# EAGLE design Status Board (EAGLE 9.2.2)
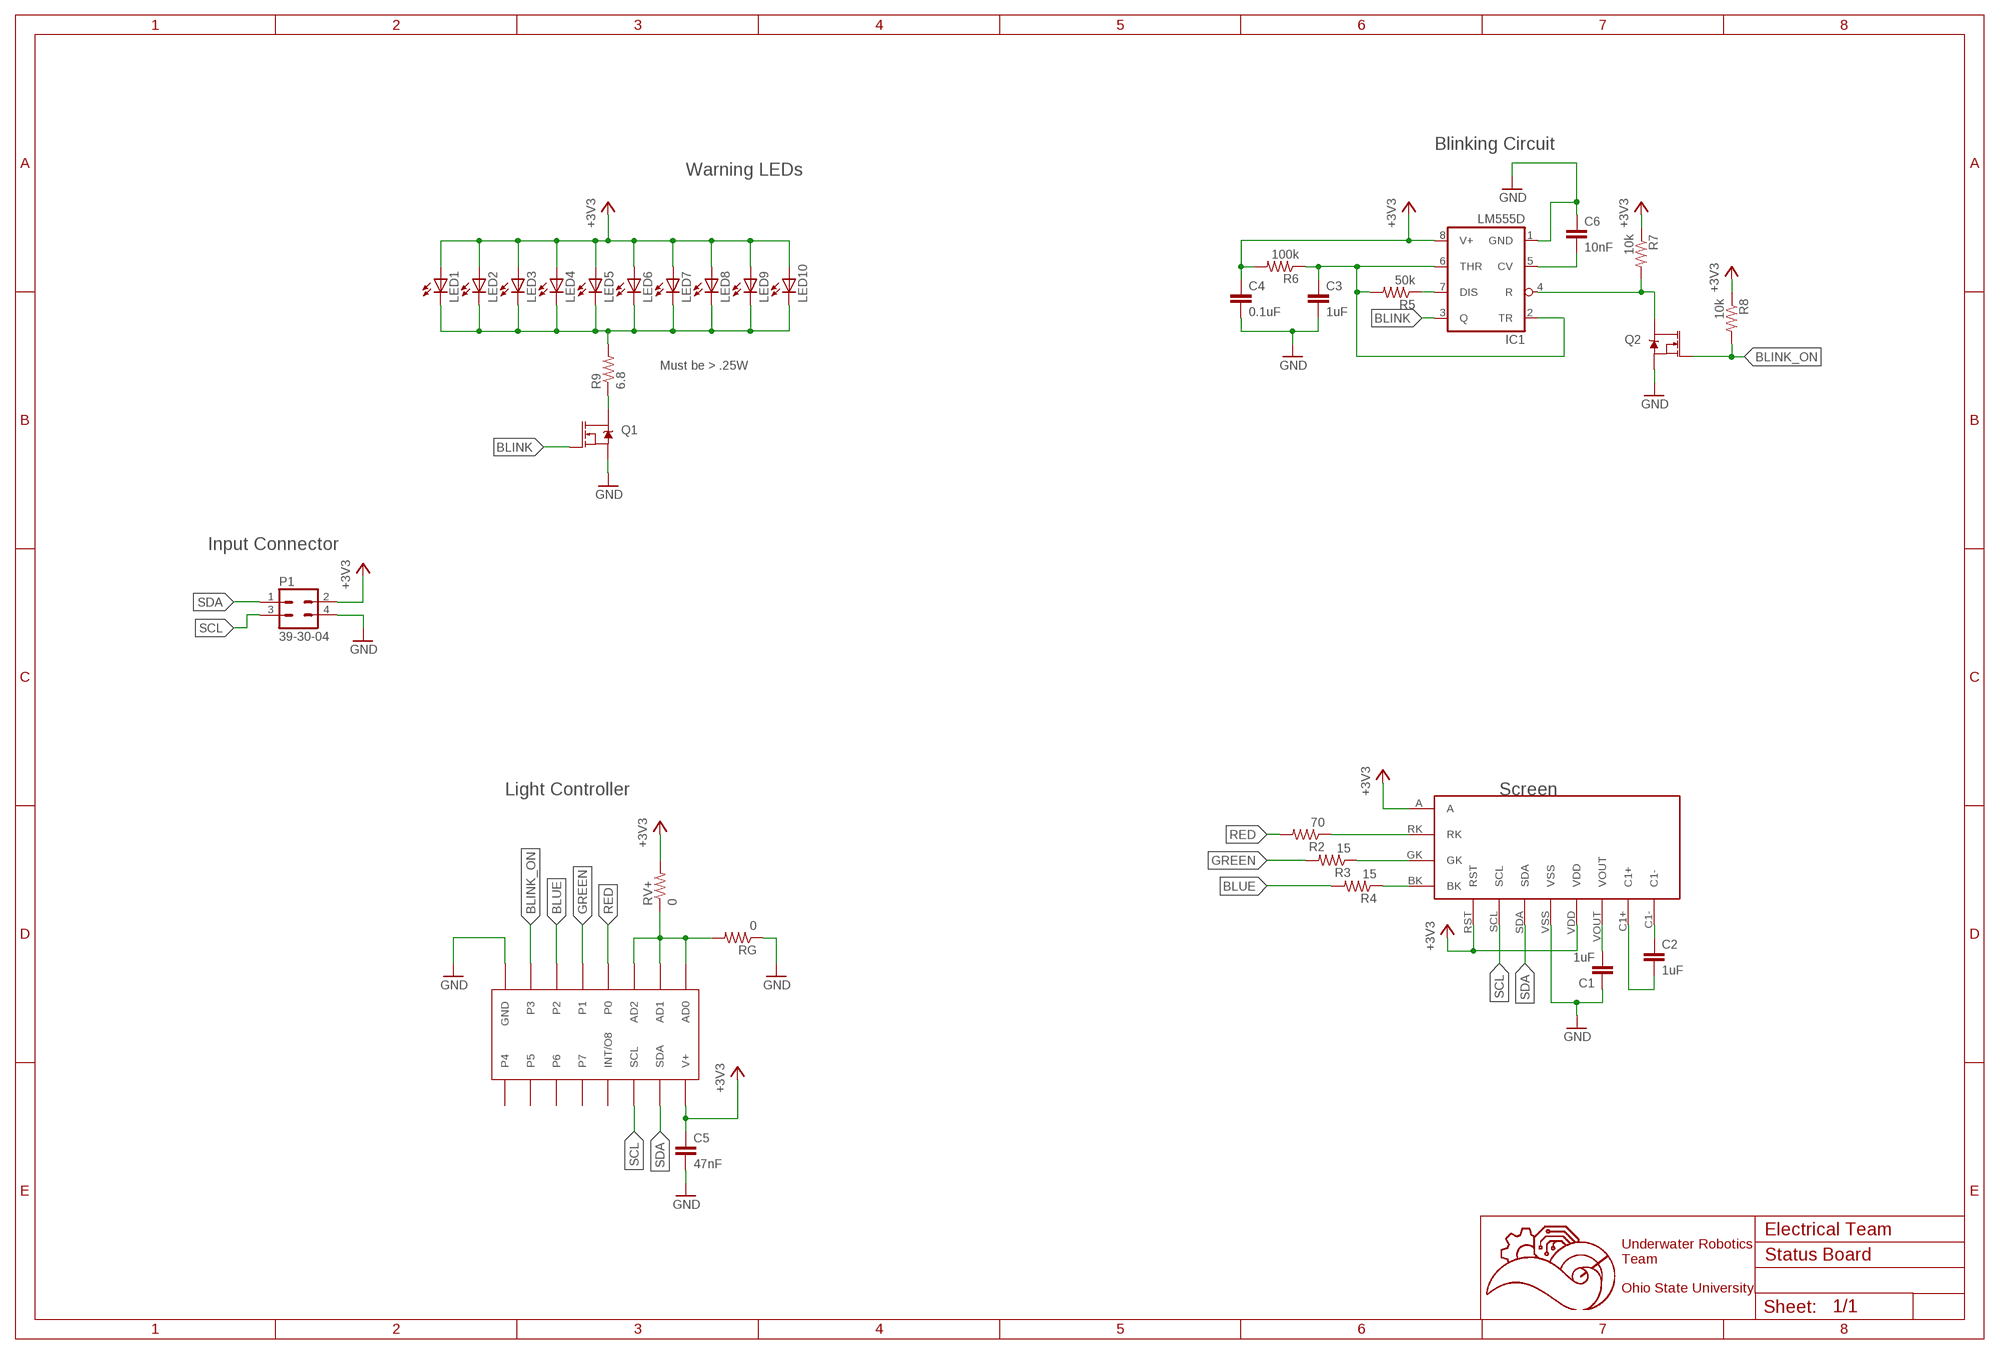
[diagram p0: schematic, sheet 1]

## Parts
C1  1uF  C-EUC0603  [C0603]
C2  1uF  C-EUC0603  [C0603]
C3  1uF  C-EUC0603  [C0603]
C4  0.1uF  C-EUC0603  [C0603]
C5  47nF  C-EUC0603  [C0603]
C6  10nF  C-EUC0603  [C0603]
IC1  LM555D  [SO08]
LED1  LEDCHIPLED_0603  [CHIPLED_0603]
LED2  LEDCHIPLED_0603  [CHIPLED_0603]
LED3  LEDCHIPLED_0603  [CHIPLED_0603]
LED4  LEDCHIPLED_0603  [CHIPLED_0603]
LED5  LEDCHIPLED_0603  [CHIPLED_0603]
LED6  LEDCHIPLED_0603  [CHIPLED_0603]
LED7  LEDCHIPLED_0603  [CHIPLED_0603]
LED8  LEDCHIPLED_0603  [CHIPLED_0603]
LED9  LEDCHIPLED_0603  [CHIPLED_0603]
LED10  LEDCHIPLED_0603  [CHIPLED_0603]
P1  39-30-04  [39-30-?04?]
Q1  310mA/60V/1.6Ω  MOSFET-NCH-2N7002PW  [SOT323]
Q2  310mA/60V/1.6Ω  MOSFET-NCH-2N7002PW  [SOT323]
R2  70  R-US_R0603  [R0603]
R3  15  R-US_R0603  [R0603]
R4  15  R-US_R0603  [R0603]
R5  50k  R-US_R0603  [R0603]
R6  100k  R-US_R0603  [R0603]
R7  10k  R-US_R0603  [R0603]
R8  10k  R-US_R0603  [R0603]
R9  6.8  R-US_R0603  [R0603]
RG  0  R-US_R0603  [R0603]
RV+  0  R-US_R0603  [R0603]
U$1  NHD-C0220BIZ  [NHD-C0220BIZ]
U$2  MAX7315  [TSSOP-16]

## Nets
+3V3: C4.1 C5.1 IC1.8(V+) LED1.A LED2.A LED3.A LED4.A LED5.A LED6.A LED7.A LED8.A LED9.A LED10.A P1.2 R6.2 R7.1 R8.1 RV+.2 U$1.A U$1.RST U$1.VDD U$2.16(V+)
BLINK: IC1.3(Q) Q1.1(G)
BLINK_OFF: IC1.4(R) Q2.3(D) R7.2
BLINK_ON: Q2.1(G) R8.2 U$2.7(P3)
BLUE: R4.2 U$2.6(P2)
GND: C1.1 C3.2 C4.2 C5.2 C6.1 IC1.1(GND) P1.4 Q1.2(S) Q2.2(S) RG.1 U$1.VSS U$2.8(GND)
GREEN: R3.2 U$2.5(P1)
N$1: R3.1 U$1.GK
N$2: C2.1 U$1.C1-
N$3: C1.2 U$1.VOUT
N$4: C2.2 U$1.C1+
N$5: R4.1 U$1.BK
N$6: RG.2 RV+.1 U$2.1(AD0) U$2.2(AD1) U$2.3(AD2)
N$7: R2.1 U$1.RK
N$8: C6.2 IC1.5(CV)
N$9: IC1.7(DIS) R5.1
N$10: C3.1 IC1.2(TR) IC1.6(THR) R5.2 R6.1
N$12: Q1.3(D) R9.1
N$20: LED1.C LED2.C LED3.C LED4.C LED5.C LED6.C LED7.C LED8.C LED9.C LED10.C R9.2
RED: R2.2 U$2.4(P0)
SCL: P1.3 U$1.SCL U$2.14(SCL)
SDA: P1.1 U$1.SDA U$2.15(SDA)
Unconnected: U$2.9(P4) U$2.10(P5) U$2.11(P6) U$2.12(P7) U$2.13(INT/O8)

## Notes on the sheet
- Blinking Circuit
- Warning LEDs
- Must be > .25W
- Input Connector
- Light Controller | Screen
- Electrical Team
- Underwater Robotics
  Team
  
  Ohio State University

## Library data of the parts
C1-C6 = rcl:C-EU: CAPACITOR, European symbol; SPICEPREFIX: C
IC1 = linear:*555: TIMER
LED1-LED10 = led:LED: LED OSRAM: - CHIPLED LG R971, LG N971, LY N971, LG Q971, LY Q971, LO R971, LY R971 LH N974, LH R974 LS Q976, LO Q976, LY Q976 LO Q996 - Hyper CHIPLED LW Q18S LB Q993, LB Q99A, LB R99A - SideLED LS A670, LO A670, LY A670, LG A670, LP A670 LB A673, LV A673, LT A673, LW A673 LH A674 LY A675 LS A676, LA A676, LO A676, LY A676, LW A676 LS A679, LY A679, LG A679 - Hyper Micro SIDELED® LS Y876, LA Y876, LO Y876, LY Y876 LT Y87S - SmartLED LW L88C, LW L88S LB L89C, LB L89S, LG L890 LS L89K, LO L89K, LY L89K LS L896, LA L896, LO L896, LY L896 - TOPLED LS T670, LO T670, LY T670, LG T670, LP T670 LSG T670, LSP T670, LSY T670, LOP T670, LYG T670 LG T671, LOG T671, LSG T671 LB T673, LV T673, LT T673, LW T673 LH T674 LS T676, LA T676, LO T676, LY T676, LB T676, LH T676, LSB T676, LW T676 LB T67C, LV T67C, LT T67C, LS T67K, LO T67K, LY T67K, LW E67C LS E67B, LA E67B, LO E67B, LY E67B, LB E67C, LV E67C, LT E67C LW T67C LS T679, LY T679, LG T679 LS T770, LO T770, LY T770, LG T770, LP T770 LB T773, LV T773, LT T773, LW T773 LH T774 LS E675, LA E675, LY E675, LS T675 LS T776, LA T776, LO T776, LY T776, LB T776 LHGB T686 LT T68C, LB T68C - Hyper Mini TOPLED® LB M676 - Mini TOPLED Santana® LG M470 LS M47K, LO M47K, LY M47K Source: http://www.osram.convergy.de LUXEON: - LUMILED® LXK2-PW12-R00, LXK2-PW12-S00, LXK2-PW14-U00, LXK2-PW14-V00 LXK2-PM12-R00, LXK2-PM12-S00, LXK2-PM14-U00 LXK2-PE12-Q00, LXK2-PE12-R00, LXK2-PE12-S00, LXK2-PE14-T00, LXK2-PE14-U00 LXK2-PB12-K00, LXK2-PB12-L00, LXK2-PB12-M00, LXK2-PB14-N00, LXK2-PB14-P00, LXK2-PB14-Q00 LXK2-PR12-L00, LXK2-PR12-M00, LXK2-PR14-Q00, LXK2-PR14-R00 LXK2-PD12-Q00, LXK2-PD12-R00, LXK2-PD12-S00 LXK2-PH12-R00, LXK2-PH12-S00 LXK2-PL12-P00, LXK2-PL12-Q00, LXK2-PL12-R00 Source: www.luxeon.com KINGBRIGHT: KA-3528ASYC Source: www.kingbright.com
P1 = con-molex-mini-fit:39-30-?04?: HEADER
Q1 Q2 = SparkFun-DiscreteSemi:MOSFET-NCH: N-channel MOSFETs Voltage controlled devices that allow control of high current outputs. SparkFun Products: SparkFun OpenScale <https://www.sparkfun.com/products/13261> SparkFun Digital Sandbox <https://www.sparkfun.com/products/12651> SparkFun Monster Moto Shield <https://www.sparkfun.com/products/10182> SparkFun MOSFET Power Controller <https://www.sparkfun.com/products/11214>; PROD_ID: TRANS-11151
R2-R9 RG RV+ = rcl:R-US_: RESISTOR, American symbol; SPICEPREFIX: R
U$1 = NHD-C0220BiZ:NHD-C0220BIZ
U$2 = MAX7315:MAX7315

## Board
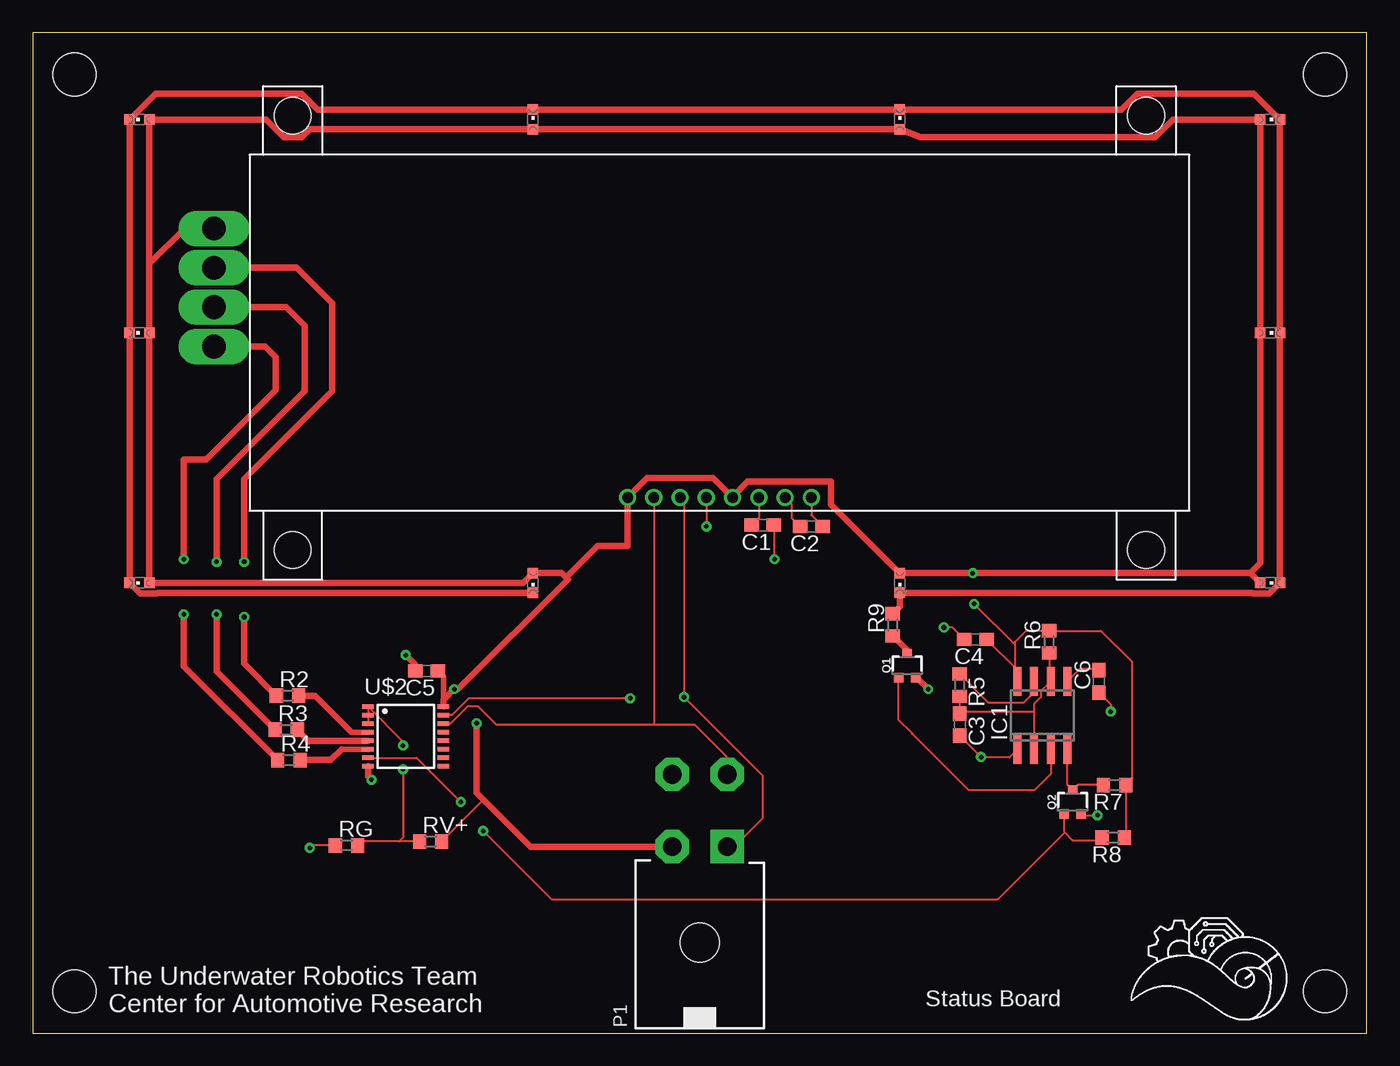
[diagram p1: board, top side]
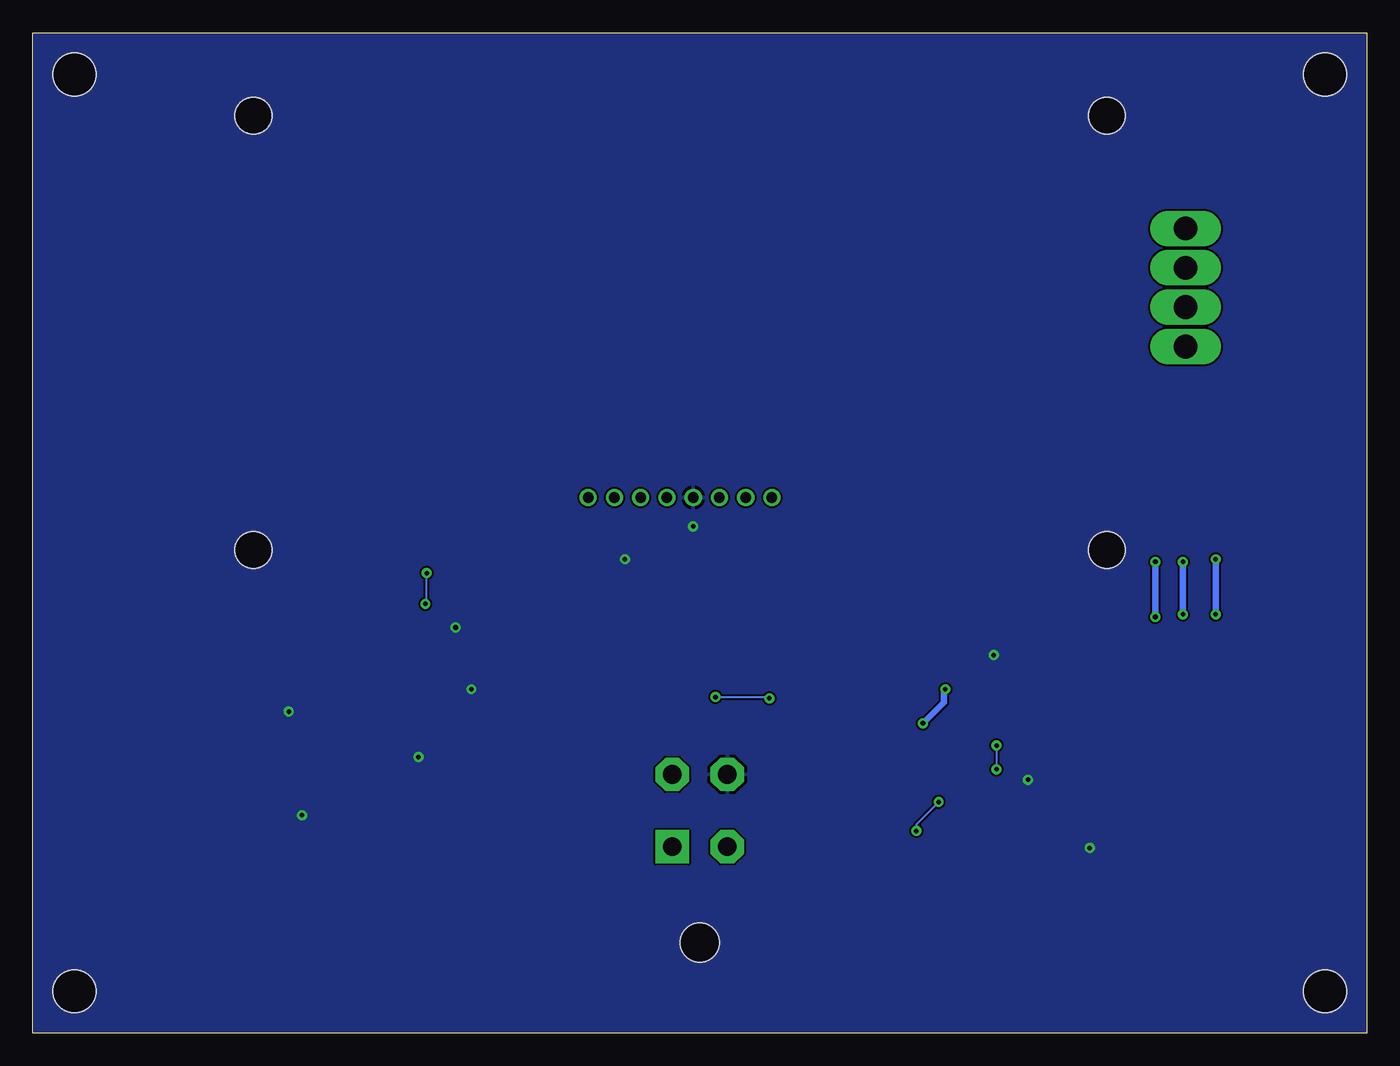
[diagram p2: board, bottom side, seen from below]

Size 101.6 x 76.2 mm. Coordinates in mm from the lower left corner, seen from the top.
Outline: 0,0 101.6,0 101.6,76.2 0,76.2 0,0
Copper layers (1*16): Top 0.035mm / dielectric 1.5mm / Bottom 0.035mm
Design rules "default *": minimum track width 6mil, minimum drill 0.35mm, track to track 6mil, track to pad 6mil, pad to pad 6mil, via to via 6mil, smd to smd 6mil, copper to edge 0.00508125mm, drill to drill 6mil, minimum pad ring 10mil, minimum via ring 8mil, stop-mask expansion 4mil, vias tented up to drill 0mil, thermal gap 10mil
Holes 3.26 mm at 3.17,73.03 98.42,73.03 3.17,3.17 98.42,3.17

### Footprints (pad centres in the part's own frame; a part is rotated, then mirrored left to right if it is on the bottom)
C0603 = smd 1.1 x 1: 1 -0.85,0; 2 0.85,0
SO08 = smd 0.6 x 2.2: 1 -1.905,-2.6; 2 -0.635,-2.6; 3 0.635,-2.6; 4 1.905,-2.6; 5 1.905,2.6; 6 0.635,2.6; 7 -0.635,2.6; 8 -1.905,2.6
CHIPLED_0603 = smd 0.8 x 0.8: A 0,-0.75; C 0,0.75
39-30-?04? = drill 1.422 pad 2.54 square: 1 2.095,0 | drill 1.422 pad 2.54 octagon: 2 -2.095,0; 3 2.095,5.512; 4 -2.095,5.512 | hole 3: 0,-7.3
SOT323 = smd 0.7 x 0.7: 1 -0.65,-0.925; 2 0.65,-0.925; 3 0,0.925
R0603 = smd 1 x 1.1: 1 -0.85,0; 2 0.85,0
NHD-C0220BIZ = drill 1.8 long: A -6,24.5; BK -6,15.5; GK -6,18.5; RK -6,21.5 | drill 0.8: C1+ 37.5,4; C1- 39.5,4; RST 25.5,4; SCL 27.5,4; SDA 29.5,4; VDD 33.5,4; VOUT 35.5,4; VSS 31.5,4 | hole 2.8: 0,0; 65,0; 65,33.1; 0,33.1
TSSOP-16 = smd 0.9 x 0.35: 1 -2.875,2.275; 2 -2.875,1.625; 3 -2.875,0.975; 4 -2.875,0.325; 5 -2.875,-0.325; 6 -2.875,-0.975; 7 -2.875,-1.625; 8 -2.875,-2.275; 9 2.875,-2.275; 10 2.875,-1.625; 11 2.875,-0.975; 12 2.875,-0.325; 13 2.875,0.325; 14 2.875,0.975; 15 2.875,1.625; 16 2.875,2.275

### Placement (x,y rotation side)
C1  55.6,38.7 180 top
C2  59.3,38.6 180 top
C3  70.6,23.5 270 top
C4  71.8,30 180 top
C5  30,27.6 180 top
C6  81.2,26.8 90 top
IC1  76.9,24.2 0 top
LED1  94.23,53.34 270 top
LED2  94.23,69.6 270 top
LED3  38.1,34.29 180 top
LED4  94.23,34.29 270 top
LED5  8.13,69.6 90 top
LED6  66.04,34.29 180 top
LED7  8.13,34.29 90 top
LED8  8.13,53.34 90 top
LED9  66.04,69.6 0 top
LED10  38.1,69.6 0 top
P1  39-30-04?  [39-30-?04?]  50.8,14.2 0 top
Q1  66.6,28 0 top
Q2  79.2,17.6 0 top
R2  19.4,25.7 0 top
R3  19.3,23.1 0 top
R4  19.5,20.8 0 top
R5  70.6,26.5 270 top
R6  77.4,29.8 90 top
R7  82.4,18.9 180 top
R8  82.3,14.9 180 top
R9  65.5,31.1 90 top
RG  23.9,14.3 0 top
RV+  30.3,14.6 0 top
U$1  19.8,36.8 0 top
U$2  28.4,22.6 0 top

### Tracks (layer width: path | path; a pad name or v marks a point on that pad's centre or on a via)
+3V3  (via drill 0.35)
  Top 0.152: 74.8,29.6 74.8,29.8 75.65,30.65 R6.2 81.35,30.65 83.7,28.3 83.7,19.35 R7.1 83.25,15 R8.1 | 74.8,29.6 74.8,27 74.95,26.85 | 74.95,26.85 IC1.8 | v71.7,32.7 74.8,29.6 | C4.1 74.95,27.7 74.95,26.85 | 34.3,17.8 34.3,17.75 RV+.2
  Top 0.406: U$1.A 13.78,61.28 | 31.27,25.38 31.27,27.18 C5.1
  Top 0.508: v33.8,23.6 33.8,18.3 34.3,17.8 37.9,14.2 P1.2 | U$2.16 31.27,25.38 v32.1,26.2 32.4,26.2 40.75,34.55 40.6,34.7 | 40.6,34.7 43,37.1 45.3,37.1 U$1.RST 46.8,42.3 51.8,42.3 U$1.VDD 53.3,40.85 54.45,42 60.8,42 60.8,40.25 66.01,35.04 LED6.A v71.6,35.04 92.73,35.04 | 92.73,35.04 LED4.A | 92.73,35.04 93.49,35.8 93.48,35.8 LED1.A LED2.A 86.84,69.6 85.49,68.24 67.61,68.24 LED9.A LED10.A 21.09,68.85 20.49,68.24 19.11,68.24 17.76,69.6 LED5.A 8.88,58.6 | 8.88,58.6 LED8.A LED7.A 37.35,34.29 LED3.A 40.26,35.04 40.6,34.7 | U$1.A 11.58,61.3 8.88,58.6
  Bottom 0.152: 32.2,26.1 v32.1,26.2 | v71.7,32.7 71.6,32.8 v71.6,35.04
  Bottom 0.508: v33.8,23.6 32.2,25.2 32.2,26.1
BLINK
  Top 0.152: IC1.3 77.53,19.73 76.3,18.5 71.3,18.5 67.05,22.75 66.95,22.85 65.95,23.85 Q1.1
BLINK_OFF
  Top 0.152: IC1.4 78.81,18.92 Q2.3 79.58,18.9 R7.2
BLINK_ON  (via drill 0.35)
  Top 0.152: 78.6,15.3 78.55,15.35 Q2.1 78.72,16.5 | 78.6,15.3 79.2,14.7 81.25,14.7 R8.2 | U$2.7 29.23,20.98 v32.6,17.6 | v34.3,15.4 39.5,10.2 73.5,10.2 78.6,15.3
  Bottom 0.152: v32.6,17.6 34.3,15.9 v34.3,15.4
BLUE
  Top 0.406: 23.52,21.61 U$2.6
  Top 0.508: R4.2 22.7,20.8 23.52,21.61
GND  (via drill 0.35)
  Top 0.152: U$1.VSS v51.3,38.6 | 75,21.32 IC1.1 74.39,21 72.25,21 v72.22,21.02 C3.2 | C6.1 82.1,25.05 v82.1,24.5 | C1.1 56.45,36.15 v56.5,36.1 | Q2.2 79.92,16.6 v81.1,16.6 | C4.2 70.05,30.9 v69.4,30.9 | RG.1 21.3,14.3 v21.1,14.1
  Top 0.406: C5.2 29.15,28.05 v28.4,28.8
  Top 0.508: Q1.2 67.33,27.07 v68.2,26.2 | U$2.8 25.52,19.57 v25.8,19.3
  pour Bottom: -1.1,77.8 -1.1,-1.4 102.8,-1.4 102.8,77.8
GREEN
  Top 0.508: R3.2 21.01,22.24 21.05,22.27 U$2.5
N$1  (via drill 0.35)
  Top 0.508: R3.1 14,27.55 v14,31.9 | v14,35.9 14,42.2 20.7,48.9 20.7,53.9 19.3,55.3 U$1.GK
  Bottom 0.508: v14,31.9 v14,35.9
N$2
  Top 0.152: U$1.C1- 59.3,39.45 C2.1
N$3
  Top 0.152: U$1.VOUT 55.3,39.25 C1.2
N$4
  Top 0.152: U$1.C1+ 57.8,40.3 57.8,39.25 C2.2
N$5  (via drill 0.35)
  Top 0.508: R4.1 11.5,27.95 v11.5,31.9 | v11.5,36.1 11.5,43.7 13.2,43.7 18.5,49 18.5,51.5 17.7,52.3 U$1.BK
  Bottom 0.508: v11.5,31.9 v11.5,36.1
N$6  (via drill 0.35)
  Top 0.152: v28.2,21.9 28.2,22.2 U$2.1 U$2.2 U$2.3 | v28.2,20.1 28.2,14.9 27.9,14.6 | RV+.1 27.9,14.6 | 27.9,14.6 25.05,14.6
  Top 0.508: 25.05,14.6 RG.2
  Bottom 0.152: v28.2,21.9 v28.2,20.1
N$7  (via drill 0.35)
  Top 0.508: v16.1,35.9 16.1,42.2 22.8,48.9 22.8,55.6 20.1,58.3 U$1.RK | R2.1 16.1,28.15 v16.1,31.7
  Bottom 0.508: v16.1,31.7 v16.1,35.9
N$8
  Top 0.152: C6.2 81.08,27.77 79.78,27.77 IC1.5
N$9
  Top 0.152: R5.1 72.75,25.2 75.5,25.2 76.27,25.96 IC1.7
N$10
  Top 0.152: IC1.6 77.42,26.68 | 77.42,26.68 76.79,26.06 76.79,25.61 76.27,25.08 76.27,24.5 | 76.27,24.5 IC1.2 | R5.2 C3.1 70.75,24.5 76.27,24.5 | R6.1 77.42,28.93 77.42,26.68
N$12
  Top 0.508: Q1.3 66.6,29.15 R9.1
N$20
  Top 0.508: LED3.C 9.5,33.54 9.45,33.48 8.18,33.48 LED7.C LED8.C LED5.C 9.34,71.56 20.49,71.56 21.7,70.35 LED10.C LED9.C 82.9,70.35 84.11,71.56 93.02,71.56 LED2.C LED1.C LED4.C 94.18,33.48 92.92,33.48 92.86,33.54 LED6.C 66.04,32.49 R9.2
RED
  Top 0.406: 21.5,25.7 24.3,22.9 25.5,22.9 U$2.4
  Top 0.508: R2.2 21.5,25.7
SCL
  Top 0.152: P1.3 52.8,19.81 52.8,21.11 50.4,23.5 47.4,23.5 | 47.4,23.5 40.1,23.5 35.3,23.5 33.89,24.91 33.15,24.91 31.82,23.57 U$2.14 | U$1.SCL 47.3,23.6 47.4,23.5
SDA  (via drill 0.35)
  Top 0.152: U$1.SDA 49.6,40.5 v49.6,25.6 55.6,19.6 55.6,16.4 53.4,14.2 P1.1 | v45.5,25.5 33.2,25.5 31.93,24.23 U$2.15
  Bottom 0.152: v49.6,25.6 45.6,25.6 v45.5,25.5

### Text on the board
tPlace: The Underwater Robotics Team / Center for Automotive Research | Status Board